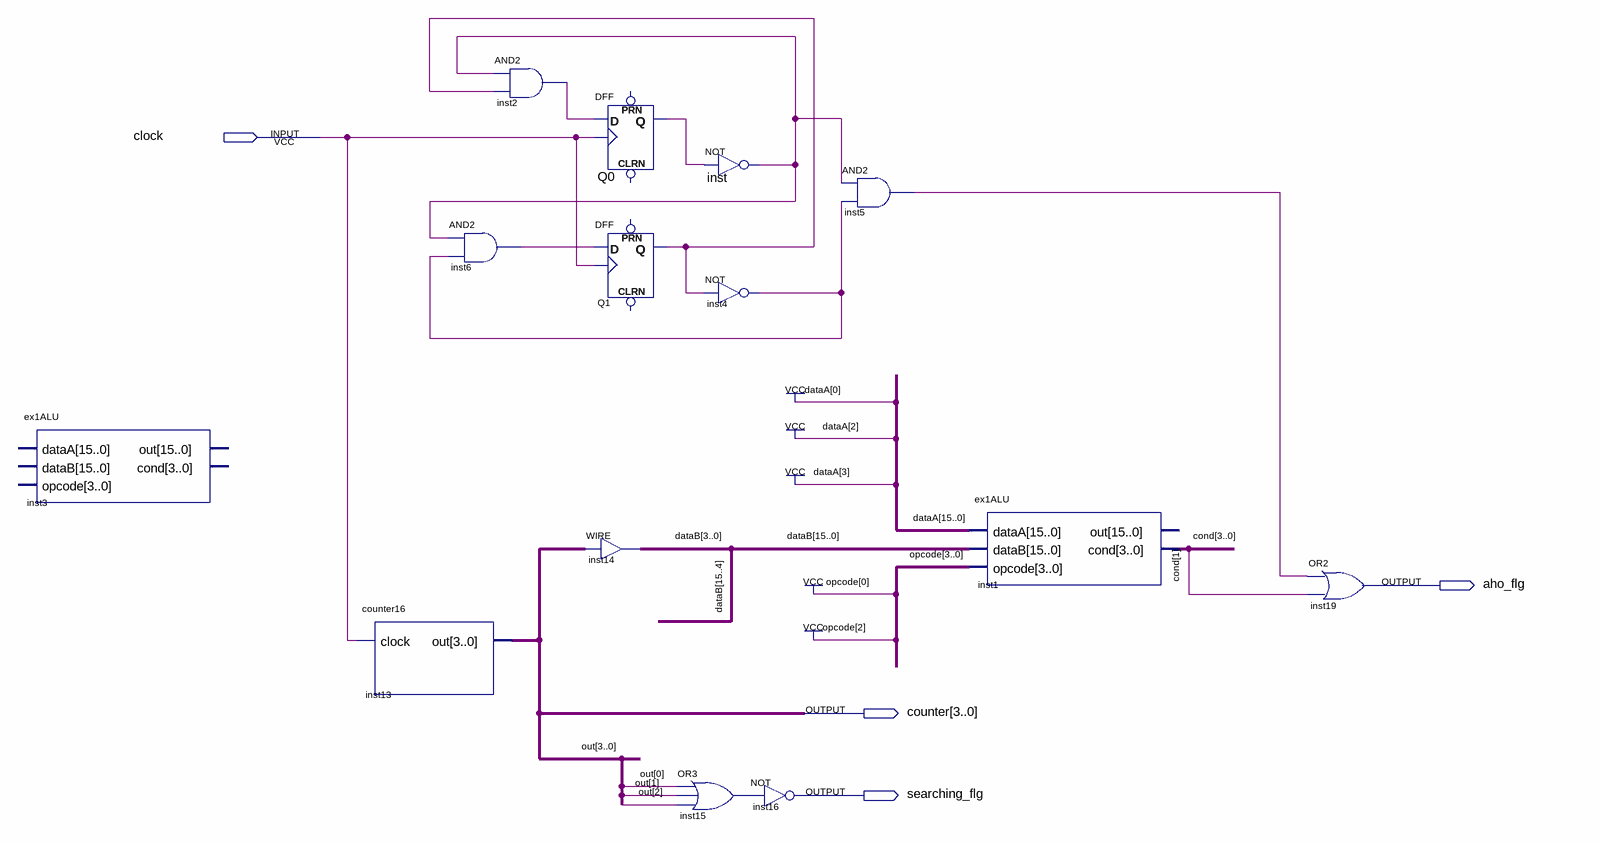
[diagram p0: schematic sheet]
// Quartus schematic ex2circuit.bdf as structural Verilog: 14 symbols, 4 pins
module ex2circuit (
  input  clock,
  output aho_flg,
  output [3:0] counter,
  output searching_flg
);

  wire inst2_out, inst4_out, inst5_out, inst6_out, inst15_out, inst_out, Q0_q, Q1_q;
  wire [3:0] cond;
  wire [3:1] opcode;
  wire [15:0] dataB;
  wire [15:1] dataA;

  ex1ALU inst3 ();  // open: dataA, dataB, opcode, out, cond
  counter16 inst13 (.clock(clock), .out(counter));
  and inst2 (inst2_out, inst_out, Q1_q);
  and inst6 (inst6_out, inst_out, inst4_out);
  assign dataB[3:0] = counter;  // WIRE inst14
  DFF Q0 (.CLK(clock), .D(inst2_out), .Q(Q0_q));  // open: CLRN, PRN
  DFF Q1 (.CLK(clock), .D(inst6_out), .Q(Q1_q));  // open: CLRN, PRN
  not inst (inst_out, Q0_q);
  not inst4 (inst4_out, Q1_q);
  or inst15 (inst15_out, counter[0], counter[1], counter[2]);
  not inst16 (searching_flg, inst15_out);
  and inst5 (inst5_out, inst_out, inst4_out);
  ex1ALU inst1 (
    .dataA({dataA[15:4], 2'b11, dataA[1], 1'b1}), .dataB(dataB), .opcode({opcode[3], 1'b1, opcode[1], 1'b1}),
    .cond(cond));  // open: out
  or inst19 (aho_flg, inst5_out, cond[1]);

  // Other names for the same wires on the sheet: out[3:0] = counter
endmodule
